# Altium schematic sheet Schematic.SchDoc: Flight Controller Based on Atmega328
size A4; ApprovedBy: Jawher MANSOUR; Author: Jawher MANSOUR; CompanyName: LAB619 Engineering & Consulting Services; Engineer: Jawher MANSOUR; Organization: LAB 619; Address1: Engineering & Consulting; Address2: Services; Address3: Drawn By :; Address4: Jawher MANSOUR; DocumentNumber: 1; Revision: V1.0; SheetNumber: 1; SheetTotal: 1; ImagePath: C:\PC Jawher\WorkSpace Kicad\LAB619\MarlinV2 Board\Logo
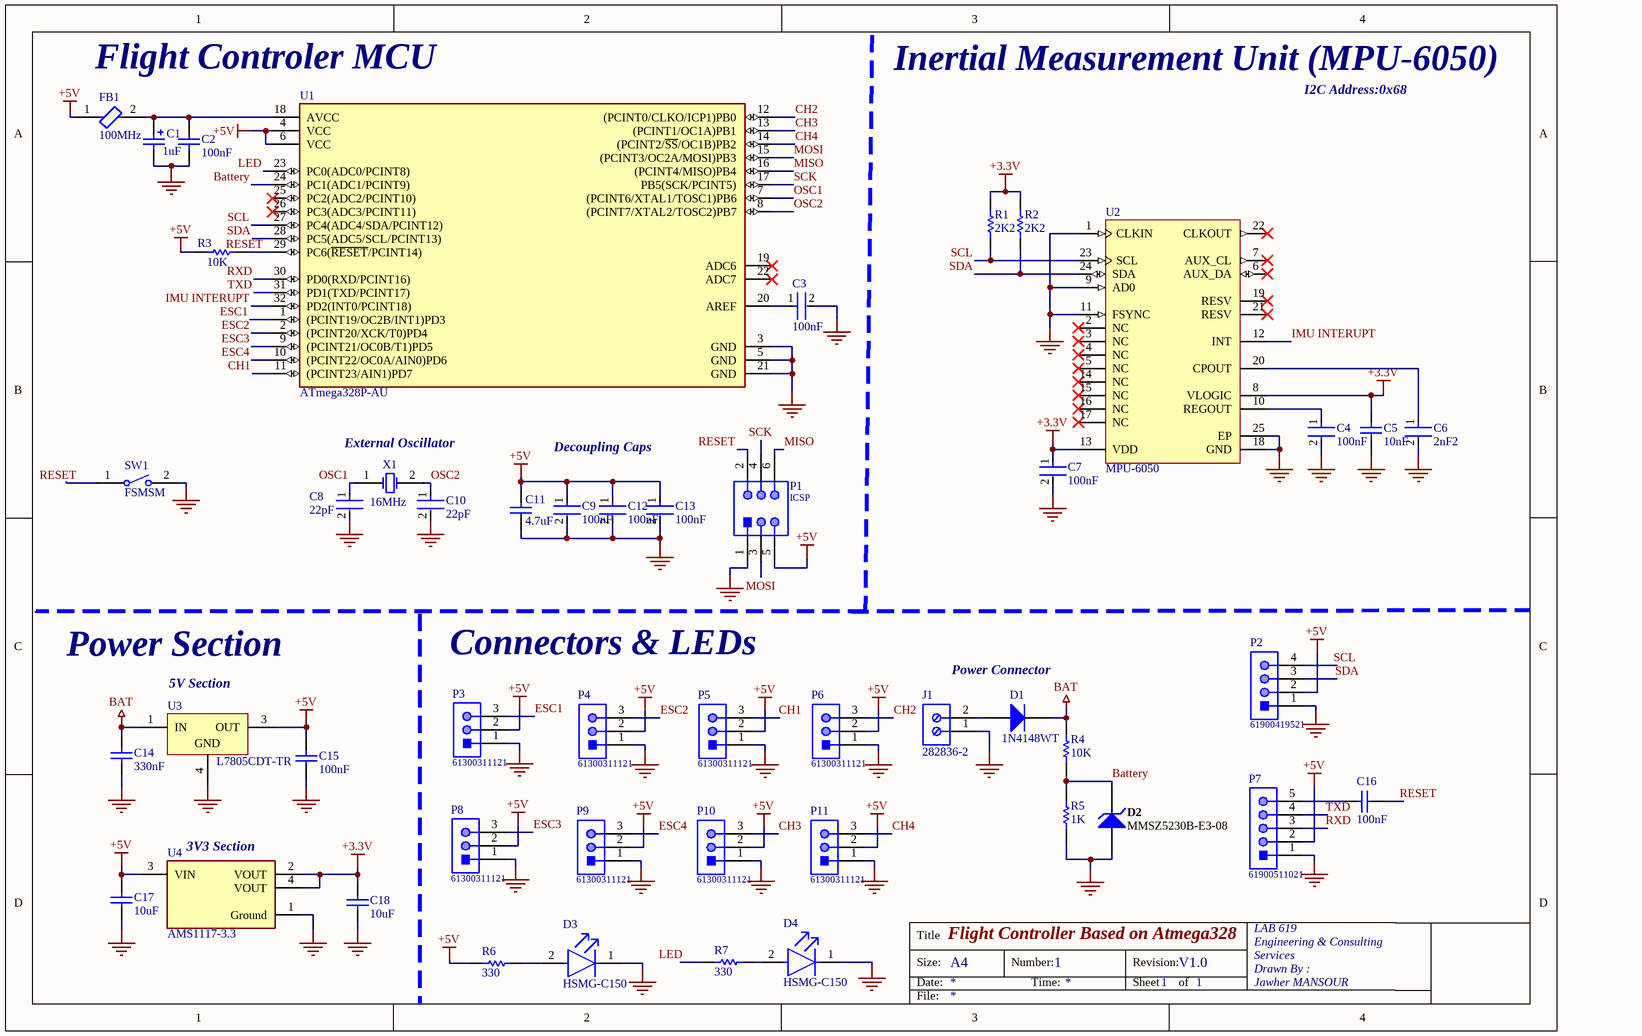
[diagram p0: Schematic.SchDoc]

## Parts
C1  value 1uF  [C1206]
C2  100nF  [CAPC3216X95X55NL15T25]
C3  100nF  [FP-GRM21B-0_15-MFG]
C4  100nF  [FP-GRM188-0_1-e0_2_0_5-IPC_B]
C5  10nF  [CAPC1608X90X35ML15T15]
C6  2nF2  [FP-C0603C-CF-MFG]
C7  100nF  [FP-GRM188-0_1-e0_2_0_5-IPC_B]
C8  22pF  [FP-C1206C-EB-MFG]
C9  100nF  [FP-GRM21B-0_15-MFG]
C10  22pF  [FP-C1206C-EB-MFG]
C11  4.7uF  [CAPC3216X95X55NL15T25]
C12  100nF  [FP-GRM21B-0_15-MFG]
C13  100nF  [FP-GRM21B-0_15-MFG]
C14  330nF  [CAPC3216X95X55NL15T25]
C15  100nF  [CAPC3216X95X55NL15T25]
C16  100nF  [CAPC3216X95X55NL15T25]
C17  10uF  [CAPC3216X95X55NL15T25]
C18  10uF  [CAPC3216X95X55NL15T25]
D1  1N4148WT  [FAIR-SOD-523F-2_V]
D2  MMSZ5230B-E3-08  [VISH-SOD-123-2_V]
D3  HSMG-C150  [FP-HSMG-C150-MFG]
D4  HSMG-C150  [FP-HSMG-C150-MFG]
FB1  100MHz  [FP-BLM21-0_2-t0_85-e0_5-IPC_A]
J1  282836-2  [TECO-282836-2_V]
P1  ICSP  [61300621121]
P2  61900419521  [61900419521]
P3  61300311121  [61300311121]
P4  61300311121  [61300311121]
P5  61300311121  [61300311121]
P6  61300311121  [61300311121]
P7  61900511021  [61900511021]
P8  61300311121  [61300311121]
P9  61300311121  [61300311121]
P10  61300311121  [61300311121]
P11  61300311121  [61300311121]
R1  2K2  [RESC3116X65X40ML10T20]
R2  2K2  [RESC3116X65X40ML10T20]
R3  10K  [RESC3116X65X40ML10T20]
R4  10K  [RESC3116X65X40ML10T20]
R5  1K  [RESC3116X65X40ML10T20]
R6  330  [RESC3116X65X40ML10T20]
R7  330  [RESC3116X65X40ML10T20]
SW1  FSMSM  [TECO-FSMSM-2_V]
U1  ATmega328P-AU  [FP-32A-MFG]
U2  MPU-6050  [IS-QFN-24_V]
U3  L7805CDT-TR  [TO-252_N]
U4  AMS1117-3.3  [FP-AMS1117-IPC_C]
X1  16MHz  [FOX-FOXSDLF160-20_V]

## Nets
+3.3V: C5.2 C7.1 C18.2 R1.1 R2.1 U2.8(VLOGIC) U2.13(VDD) U4.2(VOUT) U4.4(VOUT)
+5V: C9.1 C11.2 C12.1 C13.1 C15.2 C17.2 FB1.1 P1.5 P2.2 P3.2 P4.2 P5.2 P6.2 P7.2 P8.2 P9.2 P10.2 P11.2 R3.1 R6.2 U1.4(VCC) U1.6(VCC) U3.3(OUT) U4.3(VIN)
BAT: C14.2 D1.1(K) R4.2 U3.1(IN)
GND: C1.2 C2.1 C3.2 C4.2 C5.1 C6.2 C7.2 C8.2 C9.2 C10.2 C11.1 C12.2 C13.2 C14.1 C15.1 C17.1 C18.1 D2.1(A) D3.1(C) D4.1(C) J1.1 P1.1 P2.1 P3.1 P4.1 P5.1 P6.1 P7.1 P8.1 P9.1 P10.1 P11.1 R5.1 SW1.2 U1.3(GND) U1.5(GND) U1.21(GND) U2.1(CLKIN) U2.9(AD0) U2.11(FSYNC) U2.18(GND) U2.25(EP) U3.4(GND) U4.1(Ground)
Battery: D2.2(K) R4.1 R5.2 U1.24(PC1(ADC1/PCINT9))
CH1: P5.3 U1.11((PCINT23/AIN1)PD7)
CH2: P6.3 U1.12((PCINT0/CLKO/ICP1)PB0)
CH3: P10.3 U1.13((PCINT1/OC1A)PB1)
CH4: P11.3 U1.14((PCINT2/~{SS}/OC1B)PB2)
ESC1: P3.3 U1.1((PCINT19/OC2B/INT1)PD3)
ESC2: P4.3 U1.2((PCINT20/XCK/T0)PD4)
ESC3: P8.3 U1.9((PCINT21/OC0B/T1)PD5)
ESC4: P9.3 U1.10((PCINT22/OC0A/AIN0)PD6)
IMU INTERUPT: U1.32(PD2(INT0/PCINT18)) U2.12(INT)
LED: R7.1 U1.23(PC0(ADC0/PCINT8))
MISO: P1.6 U1.16((PCINT4/MISO)PB4)
MOSI: P1.3 U1.15((PCINT3/OC2A/MOSI)PB3)
OSC1: C8.1 U1.7((PCINT6/XTAL1/TOSC1)PB6) X1.1(X1)
OSC2: C10.1 U1.8((PCINT7/XTAL2/TOSC2)PB7) X1.2(X2)
RESET: C16.1 P1.2 R3.2 SW1.1 U1.29(PC6(~{RESET}/PCINT14))
RXD: P7.3 U1.30(PD0(RXD/PCINT16))
SCK: P1.4 U1.17(PB5(SCK/PCINT5))
SCL: P2.4 R1.2 U1.27(PC4(ADC4/SDA/PCINT12)) U2.23(SCL)
SDA: P2.3 R2.2 U1.28(PC5(ADC5/SCL/PCINT13)) U2.24(SDA)
TXD: P7.4 U1.31(PD1(TXD/PCINT17))
NetC1_1: C1.1 C2.2 FB1.2 U1.18(AVCC)
NetC3_1: C3.1 U1.20(AREF)
NetC4_1: C4.1 U2.10(REGOUT)
NetC6_1: C6.1 U2.20(CPOUT)
NetC16_2: C16.2 P7.5
NetD1_2: D1.2(A) J1.2
NetD3_2: D3.2(A) R6.1
NetD4_2: D4.2(A) R7.2

Not connected (* = marked no-connect by the designer): U1 19(ADC6)* 22(ADC7)* 25(PC2(ADC2/PCINT10))* 26(PC3(ADC3/PCINT11))*; U2 2(NC)* 3(NC)* 4(NC)* 5(NC)* 6(AUX_DA)* 7(AUX_CL)* 14(NC)* 15(NC)* 16(NC)* 17(NC)* 19(RESV)* 21(RESV)* 22(CLKOUT)*

## Notes on the sheet
- Flight Controler MCU
- Inertial Measurement Unit (MPU-6050)
- I2C Address:0x68
- External Oscillator
- Decoupling Caps
- Power Section
- (near U3) 5V Section
- Connectors & LEDs
- Power Connector
- (near U4) 3V3 Section
- Title
- Size:
- Date:
- A4
- Number:
- Time:
- Revision:
- Sheet
- of
- File:

## Library data of the parts
C1 = Cap Pol2: Polarized Capacitor (Axial); Published: 8-Jun-2000; LatestRevisionDate: 17-Jul-2002; LatestRevisionNote: Re-released for DXP Platform.; PackageReference: POLAR0.8; Publisher: Altium Limited; PackageDescription: Polarized Capacitor; 2 Leads
C2 C11 C14-C18 = CMP-1662-00007-4: Chip Capacitor, 0.1 uF, +/- 10%, 50 V, -55 to 125 degC, 1206 (3216 Metric), RoHS, Tape and Reel; Manufacturer: Murata; Voltage Rating: 50 V; Lead Pitch: 4 mm; PackageDescription: 2-Pin Surface Mount Device, Body 3.2 x 1.6 mm; DatasheetVersion: 03/2016; Min Operating Temperature: -55 degC; Package Quantity: 4000; RoHSCompliant: true; Max Operating Temperature: 125 degC; Height: 0.85 mm; Pins: 2; Length: 3.2 mm; PackageReference: 1206 (3216 Metric); Mounting Technology: Surface Mount; ComponentLink1Description: Manufacturer URL; ComponentLink2Description: Datasheet; ComponentLink1URL: http://www.murata.com/; Mount: Surface Mount; REACH SVHC: No SVHC; Packaging: Tape and Reel; ComponentLink2URL: http://search.murata.co.jp/Ceramy/image/img/A01X/G101/ENG/GRM319R71H104KA01-01.pdf
C3 C9 C12 C13 = CMP-2007-03385-2: Chip Multilayer Ceramic Capacitors for General Purpose, 0805, 22uF, X5R, 15%, 20%, 6.3V; Material: Ceramic; Max Operating Temperature: 85°C; Voltage: 6.3V; Min Operating Temperature: -55°C; Case/Package: 0805; Thickness: 0.053inch; Dielectric: X5R; Packaging: Tape and Reel; Depth: 1.25mm; Termination: SMD/SMT; Voltage Rating (DC): 6.3V; Radiation Hardening: No; Tolerance: 20%; Mount: Surface Mount; Lead Free: Lead Free; Package Quantity: 1; REACH SVHC: No SVHC; Voltage Rating: 6.3V; Capacitance: 22uF; Length: 2mm; Case Code (Imperial): 0805; Case Code (Metric): 2012; Width: 0.049inch; Height: 1.25mm
C4 C7 = CMP-1035-02595-8: Chip Multilayer Ceramic Capacitors for General Purpose, 0603, 0.10uF, X7R, 15%, 10%, 100V; Voltage Rating (DC): 100V; Capacitance: 100nF; Material: Ceramic; Packaging: Tape and Reel; Dielectric: X7R; Case Code (Imperial): 0603; Package Quantity: 1; Height: 0.8mm; Weight: 0.000222oz; Min Operating Temperature: -55°C; Depth: 0.8mm; Mount: Surface Mount; Thickness: 0.035inch; Voltage: 100V; REACH SVHC: No SVHC; Case/Package: 0603; Voltage Rating: 100V; Width: 0.8mm; Tolerance: 10%; Lead Free: Lead Free; Case Code (Metric): 1608; Radiation Hardening: No; Max Operating Temperature: 125°C; Termination: SMD/SMT; Length: 1.6mm
C5 = CMP-2006-04548-1: Manufacturer: AVX Interconnect / Elco; Part Number: 0603ZC103MAT2A
C6 = CMP-1035-02041-2: CAP CER 2200PF 100V NP0 0603; Manufacturer Part Number: C0603C222F1GACTU; Manufacturer: KEMET; Value: 2,200 pF; Temperature Characteristic: C0G; Material: Ceramic; Temperature Coefficient: 30ppm/°C; Automotive Grade: Grade 1; Tolerance: 0.01; Package: C0603C-CF; Lead Free: Yes; ComponentLink2Description: Datasheet; Device Class L2: Capacitors; Temperature: -55°C to +125°C; Mouser Description: Cap Ceramic 0.0022uF 100V C0G 1% SMD 0603 Paper T/R; Automotive: Yes; Octopart: https://octopart.com/c0603c222f1gactu-kemet-16902737; Device Class L3: Ceramic Capacitors; Capacitance: 2,200 pF; Digikey Description: CAP CER 2200PF 100V NP0 0603; RoHS: TRUE; Temperature Range High: +125°C; Voltage Rating: 100 V; Device Class L1: Passive Components; Height: 0.87mm; ComponentLink2URL: https://api.kemet.com/component-edge/download/datasheet/C0603C100J5GACAUTO.pdf; Temperature Range Low: -55°C; Category: Cap
C8 C10 = CMP-1037-00989-2: CAP CER 22PF 100V 5% NP0 1206; Manufacturer Part Number: C1206C220J1GACTU; Manufacturer: KEMET; Material: Ceramic; Automotive Grade: Grade 0; Tolerance: 0.05; Temperature Characteristic: C0G; Temperature Coefficient: 15%; Capacitance: 22 pF; Value: 22 pF; Mouser Description: 1206 22pF Ceramic Multilayer Capacitor; 100VDC; 125degC; C0G Dielec; +/-5% SMD; ComponentLink2Description: Datasheet; Digikey Description: CAP CER 22PF 100V 5% NP0 1206; Automotive: Yes; Temperature: -55°C to +150°C; Lead Free: Yes; Height: 0.88mm; Device Class L3: Ceramic Capacitors; Ipc Land Pattern Name: CAPC320160X78; ComponentLink2URL: https://content.kemet.com/datasheets/KEM_C1007_X8R_ULTRA_150C_SMD.pdf; Temperature Range High: +150°C; Device Class L1: Passive Components; Temperature Range Low: -55°C; Voltage Rating: 100 V; Category: Cap; Device Class L2: Capacitors; Octopart: https://octopart.com/c1206c220j1gactu-kemet-9145181; RoHS: TRUE; Package: C1206C-EB
D1 = CMP-0881-00001-1: High Conductance Fast Switching Diode, 75 V, -55 to 150 degC, 2-Pin SOD523F, RoHS; Manufacturer: Fairchild Semiconductor; IR (VR: 75 V)=5 uA Max.; VF: 1 V Max.; BVR (IR: 5 uA)=75 V Min.; CO: 4 pF Max.; DatasheetVersion: Rev. A2; ComponentLink1Description: Manufacturer URL; PackageDescription: 2-Pin Surface Mount Device, Body 1.2 x 0.8 mm, Height 0.7 mm; ComponentLink2URL: http://www.fairchildsemi.com/ds/1N/1N4148WT.pdf; ComponentLink2Description: Datasheet; PartNumber: 1N4148WT; ComponentLink1URL: http://www.fairchildsemi.com/; Temperature Range: -55 to 150 degC; Mounting Technology: Surface Mount; PackageReference: SOD-523F-2; RoHS: TRUE
D2 = CMP-0931-00028-1: Small Signal Zener Diode, 4.7 V +/- 5%, -55 to 155 degC, 2-Pin SOD-123, RoHS, Tape and Reel; Manufacturer: Vishay Semiconductor; Int. Construction: Single; Zener Impedance (IZT1) (Max.) (Ohm): 19; Zener Voltage (NOM.) (V): 4.7; Power Dissipation (mW): 500; Test Current (IZT1) (mA): 20; Tolerance: +/- 5%; DatasheetVersion: Rev. 1.9; ComponentLink3URL: http://www.vishay.com/docs/85774/mmsz5225.pdf; PackageReference: SOD-123-2; PackageDescription: 2-Pin SMD, Body 2.7 x 1.55 mm, Height 1.35 mm; PackageVersion: Rev. 1.9; ComponentLink1Description: Manufacturer URL; ComponentLink1URL: http://www.vishay.com/; Packing: Tape and Reel; RoHS: TRUE; ComponentLink2Description: Datasheet; ComponentLink2URL: http://www.vishay.com/docs/85774/mmsz5225.pdf; ComponentLink3Description: Package Specification; Mounting Technology: Surface Mount; PartNumber: MMSZ5230B-E3-08; Operating Temperature: -55 to 150 degC
D3 D4 = CMP-2000-05061-2: LED GREEN DIFFUSED 1206 SMD; Manufacturer: Broadcom; Led Orientation: Top View; Max Junction Temp: +95°C; Peak Emmision Wavelength: 570nm; Viewing Angle: 170°; Wavelength: 572nm; Reverse Voltage: 5V; Luminous Intensity: 15mcd; Forward Voltage: 2.2V; Power Dissipation: 65mW; Forward Current: 20mA; ComponentLink2Description: Datasheet; Lead Free: Yes; Temperature Range Low: -40°C; Package: HSMG-C150; Digikey Description: LED GREEN DIFFUSED 1206 SMD; Mouser Description: LED Uni-Color Green 570nm 2-Pin Chip LED T/R; Manufacturer Part Number: HSMG-C150; Temperature Range High: +85°C; Device Class L1: Optoelectronics; Colour: Green; Category: Diode; Device Class L3: unset; RoHS: TRUE; Height: 1.2mm; ComponentLink2URL: https://docs.broadcom.com/docs/AV02-0551EN; Device Class L2: LEDs; Automotive: No; Ipc Land Pattern Name: DIOCP320160X55; Octopart: https://octopart.com/hsmg-c150-broadcom-71131304; Temperature: -40°C to +85°C
FB1 = CMP-0686-00716-3: FERRITE BEAD 120 OHM 0805 1LN; Number of Lines: 1; DC Resistance-Max: 100mR; Material: Steel; Max DC Current: 200mA; Shielding: Unshielded; Impedance: 120R; Current Rating: 800mA; Max Current Rating: 1A; Resistance: 150mR; Tolerance: 25%; Width: 1.25mm; Number of Circuits: 1; Military Standard: Not; Height: 0.85mm; Test Frequency: 100MHz; Series: BLM21A; Min Operating Temperature: -55°C; DC Resistance (DCR): 100mR; Termination: SMD/SMT; Core Material: Ferrite; REACH SVHC: No SVHC; Radiation Hardening: No; Max Operating Temperature: 125°C; Number of Pins: 2; Case/Package: 0805; Case Code (Imperial): 0805; Frequency: 100MHz; Depth: 1.25mm; Length: 2mm; DC Current: 200mA; Lead Free: Lead Free; Case Code (Metric): 2012; Package Quantity: 1; Packaging: Tape and Reel
J1 = CMP-1684-00017-1: Female Header, Pitch 5 mm, 1 x 2 Position, Height 10 mm, Tail Length 3.5 mm, Rohs, Bulk; Manufacturer: TE Connectivity; Wire Gauge: 16-30AWG; Product Training Modules: Wire-to-BoardEurostyleTerminalBlocks; Clamp Material - Plating: Brass-NickelPlated; Voltage: 300V; Mating Orientation: HorizontalwithBoard; Current: 13.5A; Pitch: 0.197"(5.00mm); Screw Thread: M3; 3D Model: 282836-2.pdf; Other Names: 5ULV-02B / A98076; Dynamic Catalog: BuchananSeries; Number of Levels: 1; Torque - Screw: 0.68Nm(6Lb-In); Featured Product: EurostyleTerminalBlockConnectors; Positions Per Level: 2; Wire Termination: Screw-RisingCageClamp; Datasheet URL: http://www.te.com.cn/commerce/DocumentDelivery/DDEController?Action=showdoc&DocId=Catalog+Section%7F1308389_EUROSTYLE_TERMINAL_BLOCKS%7F0607%7Fpdf%7FEnglish%7FENG_CS_1308389_EUROSTYLE_TERMINAL_BLOCKS_0607.pdf%7F282836-2; Color: Green; Family: TerminalBlocks-WiretoBoard; RoHS Information: 282836-2StatementofCompliance; Standard Package: 300; Contact Material - Plating: Brass-TinPlated; Manufacturer URL: http://www.te.com; Housing Material: Polyamide(PA66),Nylon6/6; Features: Interlocking(Side); Package Description: Female Header, Pitch 5 mm, 1 x 2 Position, Height 10 mm, Tail Length 3.5 mm; Mounting Type: ThroughHole; Package Reference: THD; Packaging: Bulk; Series: Buchanan; Category: Connectors,Interconnects; Screw Material - Plating: Brass-NickelPlated
P1 = CMP-1502-01072-1: THT Vertical Pin Header WR-PHD, Pitch 2.54 mm, Dual Row, 6 pins; Manufacturer: Wurth Elektronik; Contact Resistance: 20mOhm; Withstanding Voltage: 500VAC; Pin Number: 6; Gender: Male; Pitch: 2.54mm; Working Voltage: 250VAC; Rated Current: 3A; Packaging: Bag; Row Number: Dual; Manufacturer URL: http://www.we-online.de; Part Number: 61300621121; Operating Temperature: -40to105degC; Mounting Technology: THT; Package Reference: 61300621121; Datasheet URL: https://katalog.we-online.de/em/datasheet/6130xx21121.pdf; Orientation: Vertical; Publisher: WurthElektronik
P2 = CMP-1502-00601-1: Male Top Locking Header WR-WTB, THT, Right Angled, pitch 2.54 mm, 1 x 4 position; Manufacturer: Wurth Elektronik; Working Voltage: 250VAC; Contact Resistance: 20mOhm; Pitch: 2.54mm; Position: 1x4; Mounting Technology: THT; Package Reference: 61900419521; Publisher: WurthElektronik; Packaging: Bag; Datasheet URL: https://katalog.we-online.de/em/datasheet/6190xx19521.pdf; Part Number: 61900419521; Manufacturer URL: http://www.we-online.de; Gender: Male; Orientation: RightAngled; Operating Temperature: -40to105degC
P3-P6 P8-P11 = CMP-1502-01062-1: THT Vertical Pin Header WR-PHD, Pitch 2.54 mm, Single Row, 3 pins; Manufacturer: Wurth Elektronik; Withstanding Voltage: 500VAC; Working Voltage: 250VAC; Rated Current: 3A; Pitch: 2.54mm; Pin Number: 3; Gender: Male; Contact Resistance: 20mOhm; Package Reference: 61300311121; Manufacturer URL: http://www.we-online.de; Datasheet URL: https://katalog.we-online.de/em/datasheet/6130xx11121.pdf; Operating Temperature: -40to105degC; Part Number: 61300311121; Orientation: Vertical; Packaging: Bag; Row Number: Single; Mounting Technology: THT; Publisher: WurthElektronik
P7 = CMP-1502-00595-1: Male Bottom Locking Header WR-WTB, THT, Right Angled, pitch 2.54 mm, 1 x 5 position; Manufacturer: Wurth Elektronik; Working Voltage: 250VAC; Contact Resistance: 20mOhm; Position: 1x5; Pitch: 2.54mm; Package Reference: 61900511021; Packaging: Bag; Part Number: 61900511021; Operating Temperature: -40to105degC; Gender: Male; Publisher: WurthElektronik; Mounting Technology: THT; Orientation: RightAngled; Datasheet URL: https://katalog.we-online.de/em/datasheet/6190xx11021.pdf; Manufacturer URL: http://www.we-online.de
R1-R7 = CMP-1014-00623-2: Chip Resistor, 10 KOhm, +/- 1%, 0.25 W, -55 to 155 degC, 1206 (3216 Metric), RoHS, Tape and Reel; Manufacturer: Yageo; Voltage Rating: 200V; Resistance: 10KOhm; Temperature Coefficient: 100ppm/degreesC; Power Rating: 250mW; Packaging: TapeandReel; Termination: SMD/SMT; REACH SVHC: Unknown; Tolerance: 1%; Height: 0.55mm; Composition: ThickFilm; Max Operating Temperature: 155degC; Datasheet Version: Rev. 5, 10/2016; Lead Free: LeadFree; Case Code (Metric): 3216; Depth: 1.6mm; Package Quantity: 5000; RoHSCompliant: true; Military Standard: Not; Case/Package: 1206; Case Code (Imperial): 1206; Min Operating Temperature: -55degC; Datasheet URL: http://www.yageo.com/NewPortal/yageodocoutput?fileName=/pdf/R-Chip/PYu-RC_Group_51_RoHS_L_5.pdf; Length: 3.1mm; Manufacturer URL: http://www.yageo.com/; Package Reference: 1206.0; Width: 1.6mm; Package Description: 2-Pin Surface Mount Device, Body 3.1 x 1.6 mm
SW1 = CMP-2000-07511-1: FSMSM Push Button Switch, 50 mA, -35 to 85 degC, 2-Pin SMD, RoHS, Bulk; Manufacturer: TE Connectivity; Actuator Length: 1.07mm; Electrical Life: 20000Cycles; Actuator Material: Polyamide; Current Rating: 50mA; Illumination Type: Illuminated; Voltage Rating (DC): 24V; Contact Resistance: 100mOhm; Case\/Package: SMD/SMT; Operating Force: 180gf; Switch Travel: 0.25mm; Max Voltage Rating (DC): 12V; Throw Configuration: SPST; Packaging: LoosePiece; Max Operating Temperature: 85degC; ELV: Compliant; Package Description: 2-Pin Surface Mount Device, Body 6 x 3.5 mm, Pitch 9.19 mm; RoHSCompliant: true; Manufacturer URL: http://www.te.com/; Contact Plating: Silver; Contact Material: Brass; Mounting Technology: SurfaceMount; Contact Current Rating: 50mA; Datasheet Version: Rev. C2, 08/2014; Datasheet URL: http://www.te.com/commerce/DocumentDelivery/DDEController?Action=showdoc&DocId=Customer+Drawing%7F1437566-3%7FC2%7Fpdf%7FEnglish%7FENG_CD_1437566-3_C2_1437566_3_1_c.dwg.pdf%7F1437566-3; Mechanical Life: 20000Cycles; Package Reference: FSMSM; REACH SVHC: Unknown; Orientation: Straight; Min Operating Temperature: -35degC; Lead Free: LeadFree; Termination: GullWing; Package Quantity: 1000; Mount: SurfaceMount
U1 = CMP-06276-000013-1: IC MCU 8BIT 32KB FLASH 32TQFP; Manufacturer: Microchip; Nominal Supply Current: 0.04-5.2mA; Number Of Timers/Counters: 3; Number Of Adc Channels: 8; Number Of I2C Channels: 1; Min Supply Voltage: 1.8V; Standoff Height: 0.05mm; Data Bus Width: 8bits; Ram Size: 2KBytes; Max Supply Voltage: 5.5V; Interface: I2C,SPI,UART,USART,2-Wire; Frequency: 20MHz; Number Of Pwm Channels: 6; Memory Size: 32KBytes; Number Of I/Os: 23; Core Architecture: AVR; Temperature: -40°C to +85°C; Number Of Spi Channels: 1; Digikey Description: IC MCU 8BIT 32KB FLASH 32TQFP; Category: IC; RoHS: TRUE; Memory Type: FLASH; Package: 32A; ComponentLink2Description: Datasheet; Number Of Uart Channels: 1; Temperature Range High: +85°C; Octopart: https://octopart.com/atmega328p-au-microchip-77760215; Footprint Url: http://ww1.microchip.com/downloads/en/appnotes/atmel-8826-seeprom-pcb-mounting-guidelines-surface-mount-packages-applicationnote.pdf; Lead Free: Yes; Device Class L1: Integrated Circuits (ICs); Device Class L2: Embedded Processors and Controllers; Ipc Land Pattern Name: QFP80P900X900X120-32; Number Of A/D Converters: 1; Number Of Cores: 1; Automotive: No; Temperature Range Low: -40°C; Mouser Description: ATmega Series 32 KB Flash 2 KB SRAM 20 MHz 8-Bit Microcontroller - TQFP-32; ComponentLink2URL: http://ww1.microchip.com/downloads/en/DeviceDoc/ATmega48A-PA-88A-PA-168A-PA-328-P-DS-DS40002061A.pdf; Height: 1.2mm; Manufacturer Part Number: ATmega328P-AU; Device Class L3: Microcontrollers
U2 = CMP-1753-00002-2: 3-Axis Gyroscope, Accelerometer and a Digital Motion Processor(TM) (DMP), 2.375 to 3.46 V, -40 to 85 degC, 24-Pin QFN, RoHS, Tape and Reel; Manufacturer: InvenSense; Featured Product: MPU-60506-Axis,IntegratedI²CSolution; Other Names: 1428-1007-2 / MPU6050; Sensor Type: MotionTracking; Online Catalog: MPU-6000™Series; Unit PriceUSD: Digital; Datasheet Version: Rev. 3.3, 05/2012; Category: Sensors,Transducers; Datasheet URL: http://datasheet.octopart.com/MPU-6050-InvenSense-datasheet-14421344.pdf; Family: Multifunction; Standard Package: 5,000; Manufacturer URL: http://www.invensense.com/; Output Type: Digital; Dynamic Catalog: MPU-6000™Series
U3 = CMP-0244-00216-1: Positive Voltage Regulator, 3-Pin DPAK, Tape and Reel; PackageVersion: 2011; PackageReference: TO-252; DatasheetVersion: 16/11/2011; PackageDescription: 3-Pin Transistor Outline Package 2.28 mm Pitch, 9.7 mm Lead Span (DPAK); ComponentLink1URL: http://www.st.com; ComponentLink2Description: Datasheet; ComponentLink1Description: Manufacturer URL; ComponentLink2URL: http://www.st.com/internet/com/TECHNICAL_RESOURCES/TECHNICAL_LITERATURE/DATASHEET/CD00000444.pdf
U4 = CMP-209535-000001-1: LDO Voltage Regulators 1A, 3.3V; Manufacturer: Advanced Monolithic Systems; Dropout Voltage: 1.1V; Output Type: Fixed; Nominal Supply Current: 5mA; Max Power Dissipation: 1.2W; Max Supply Voltage: 15V; Number Of Outputs: 1; Standoff Height: 0.64mm; Max Junction Temp: +125°C; Height: 1.8mm; Package: AMS1117; Device Class L2: Power Management ICs; ComponentLink2Description: Datasheet; ComponentLink2URL: http://www.advanced-monolithic.com/pdf/ds1117.pdf; Category: IC; RoHS: TRUE; Automotive: No; Device Class L1: Integrated Circuits (ICs); Output Current: 1A; Device Class L3: Voltage Regulators - Linear; Temperature: -40°C to +125°C; Output Voltage: 3.3V; Manufacturer Part Number: AMS1117-3.3; Temperature Range Low: -40°C; Octopart: https://octopart.com/ams1117-3.3-advanced+monolithic+systems-25899300; Lead Free: Yes; Ipc Land Pattern Name: SOT229P700X180-4; Temperature Range High: +125°C
X1 = CMP-1749-00001-1: Resistance Weld SMD Crystal, 16 MHz, +/- 30 ppm, 20 pF, -20 to 70 degC, 2-Pin SMD, RoHS, Tape and Reel; Output Current: 3 mA; Case\Package: SOT-553-6; Min Supply Voltage (DC): 4 V; Max Supply Voltage: 3.3 V; Min Supply Voltage: 1.4 V; Interface: I2C; Max Supply Voltage (DC): 6 V; ComponentLink2Description: Datasheet; REACH SVHC: No SVHC; ComponentLink1URL: http://www.foxonline.com/; ComponentLink2URL: http://foxonline.com/pdfs/hc49sdlf.pdf; Pins: 6; Packaging: Cut Tape; ComponentLink1Description: Manufacturer URL; Weight: 9.9E-05 oz; Length: 1.6 mm; RoHSCompliant: true; Min Operating Temperature: -55 degC; Radiation Hardening: No; PackageDescription: 2-Pin Surface Mount Device, Body 5 x 11.7 mm, Height 4.5 mm; Package Quantity: 1; Width: 1.2 mm; DatasheetVersion: Mar-15; Max Operating Temperature: 150 degC; Mount: Surface Mount; PackageReference: FOX-FOXSDLF160-20; Height: 0.55 mm